# EAGLE design max636 (EAGLE 7.1.0)
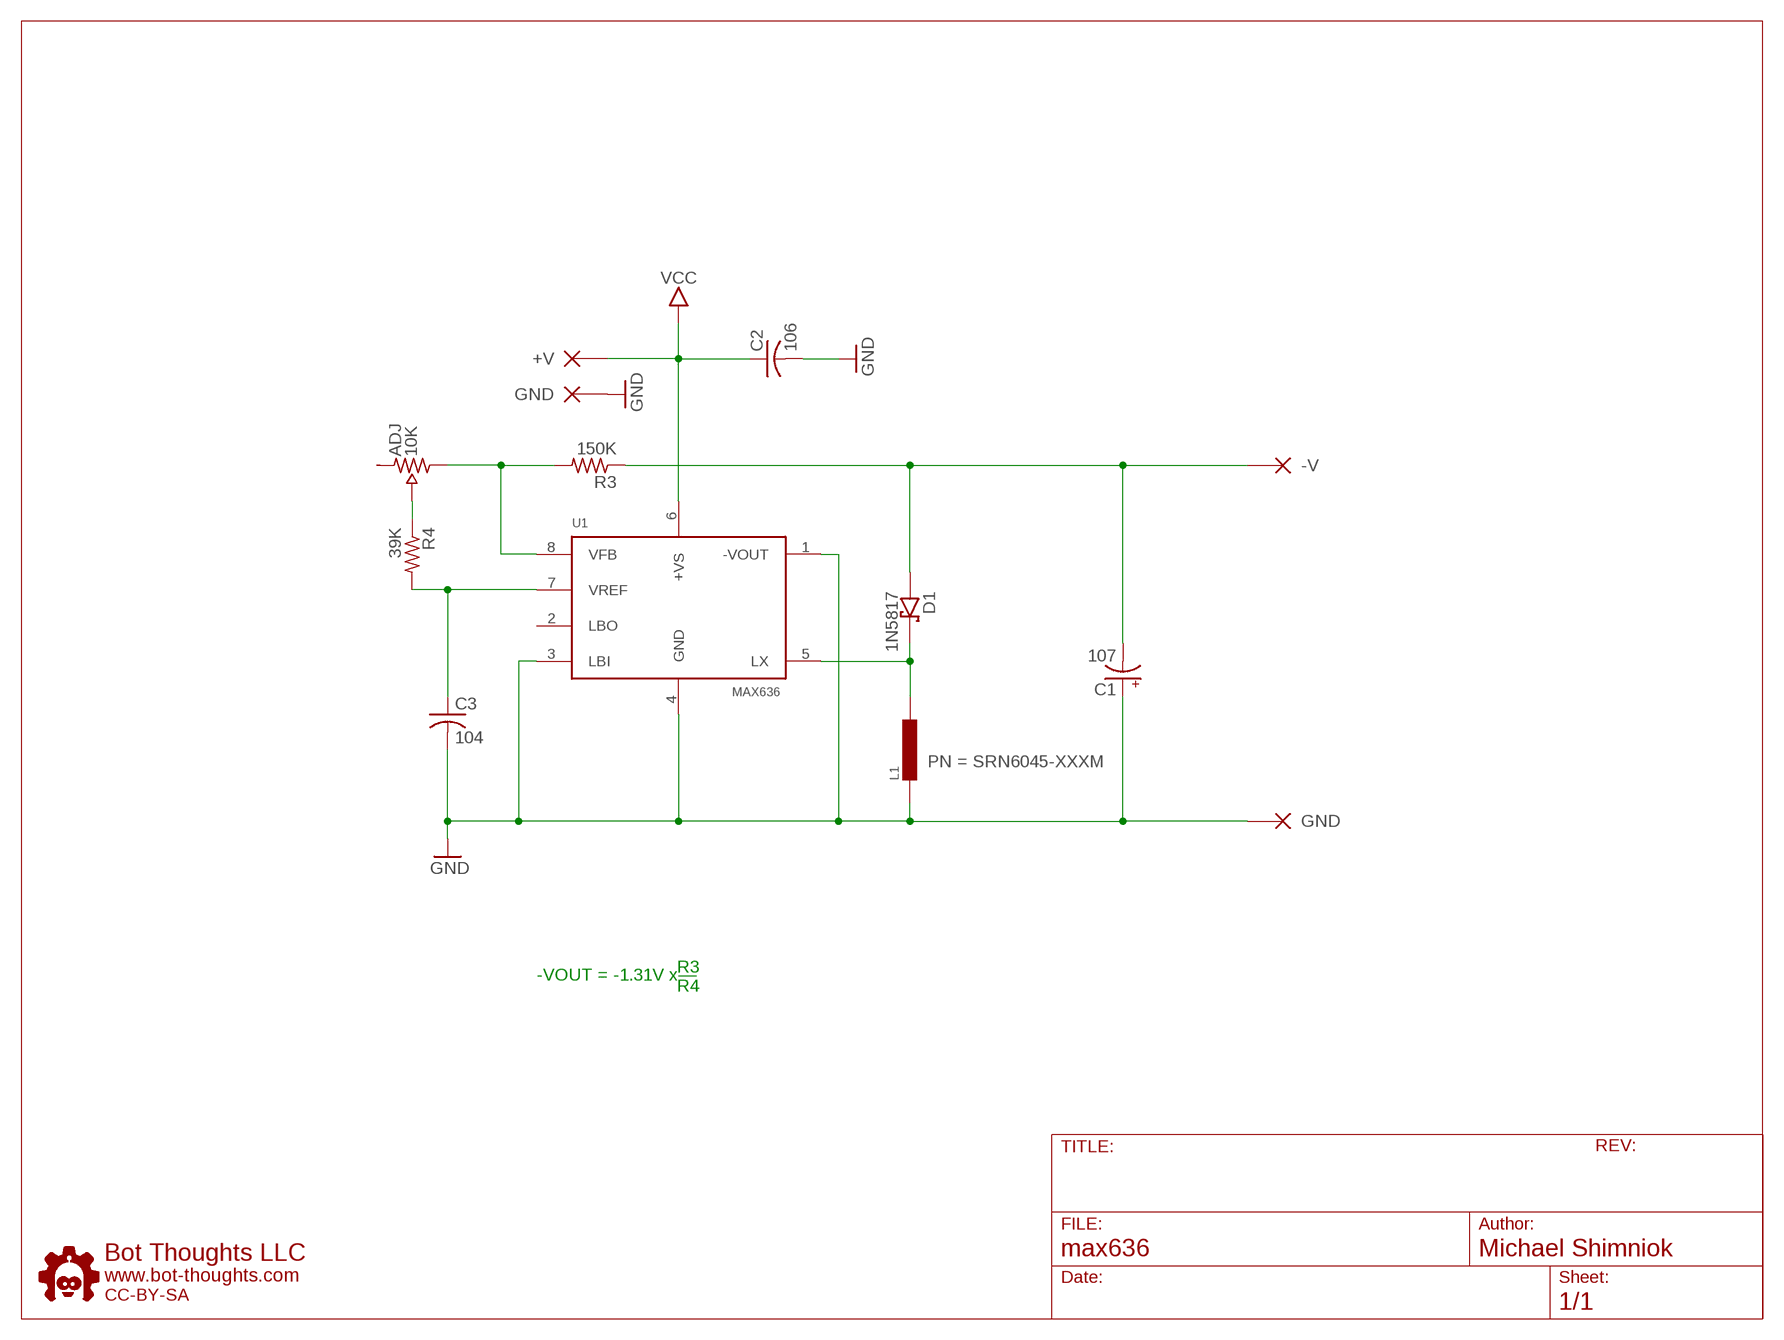
[diagram p0: schematic, sheet 1]

## Parts
ADJ  10K  TRIM-35WR  [35WR]
C1  107  CPOL_SMC_B  [SMC_B]
C2  106  C-0603  [0603]
C3  104  C-0603  [0603]
D1  1N5817  SCHOTTKY-DIODE-B5817WS-TP  [SOD-323]
J1  +V  PINHEAD-1  [1X01-S]
J2  -V  PINHEAD-1  [1X01-S]
J3  GND  PINHEAD-1  [1X01-S]
J4  GND  PINHEAD-1  [1X01-S]
L1  INDUCTOR-VLS6045EX  [VLS6045EX]
R3  150K  R0603  [0603]
R4  39K  R0603  [0603]
U1  MAX636  MAX636SO8  [SO08]
U$1  BTLOGO-LOGO-SM  [BTLOGOS]

## Nets
GND: C1.+ C2.2(-) C3.2(-) J3.1(P) J4.1(P) L1.1 U1.1(-VOUT) U1.3(LBI) U1.4(GND)
N$1: D1.C L1.2 U1.5(LX)
N$2: ADJ.1(A) R3.2 U1.8(VFB)
N$3: C1.- D1.A J2.1(P) R3.1
N$5: ADJ.2(WIPER) R4.1
N$6: C3.1(+) R4.2 U1.7(VREF)
VCC: C2.1(+) J1.1(P) U1.6(+VS)
Unconnected: ADJ.3(B) U1.2(LBO)

## Notes on the sheet
- -VOUT = -1.31V x
- R3
  R4

## Library data of the parts
ADJ = bt_electromech:TRIM-: POTENTIOMETER (TRIM, TRIMPOT, POT) 3-pin trim potentiometer in various packages
C1 = bt_rcl:CPOL: Capacitor, Polarized, American symbol
C2 C3 = bt_rcl:C: Capacitor, non-polarized, American symbol
D1 = bt_diode:SCHOTTKY-DIODE: Schottky Diode
J1-J4 = bt_electromech:PINHEAD-1: PIN HEADER 1x1, Small Symbol 1x1 pin header with small symbol makes it easier to build breakout boards
L1 = bt_inductor:INDUCTOR: Generic Inductor; PN: SRN6045-XXXM
R3 R4 = bt_rcl:R: Resistor, American symbol
U1 = bt_regulator:MAX636: MAX635, MAX636, MAX637 Inverting Switching Regulator The MAX635/MAX636/MAX637 inverting switching regulators are designed for minimum component DC-DC conversion in the 5mw to 500mW range. datasheet.pdf <https://www.analog.com/media/en/technical-documentation/data-sheets/max635-max637.pdf>
U$1 = bt:BTLOGO: Bot Thoughts Logo

## Board
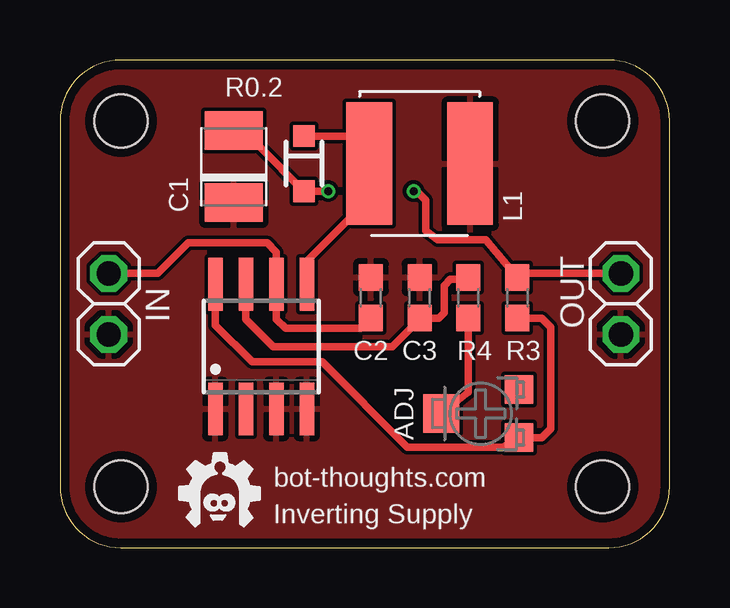
[diagram p1: board, top side]
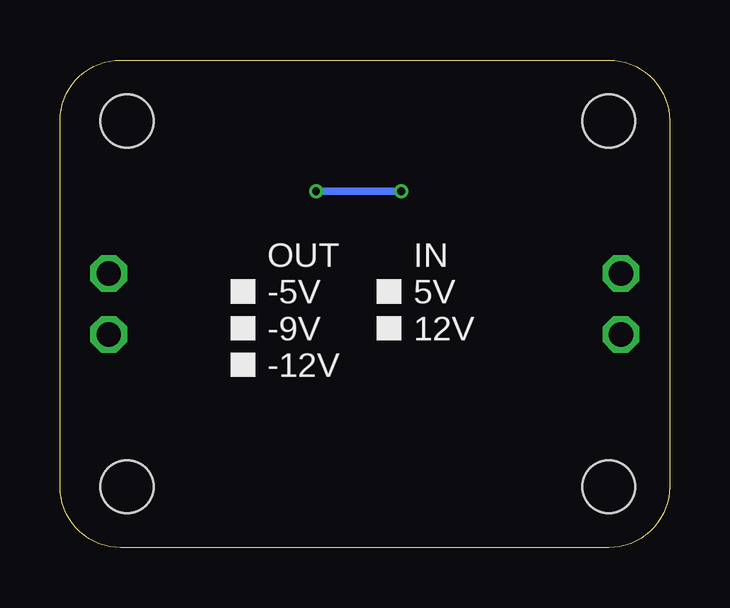
[diagram p2: board, bottom side, seen from below]

Size 25.4 x 20.32 mm. Coordinates in mm from the lower left corner, seen from the top.
Outline: 0,17.78 0,2.54 arc90 2.54,0 22.86,0 arc90 25.4,2.54 25.4,17.78 arc90 22.86,20.32 2.54,20.32 arc90 0,17.78
Copper layers (1*16): Top 0.035559375mm / dielectric 1.6mm / Bottom 0.035559375mm
Design rules "oshpark-2layer": minimum track width 6mil, minimum drill 10mil, track to track 6mil, track to pad 6mil, pad to pad 6mil, via to via 6mil, smd to smd 0mil, copper to edge 15mil, drill to drill 6mil, minimum pad ring 5mil, minimum via ring 5mil, stop-mask expansion 2.5mil, vias tented up to drill 13mil, thermal gap 10mil
Holes 2.2 mm at 2.54,2.54 2.54,17.78 22.61,17.78 22.61,2.54

### Footprints (pad centres in the part's own frame; a part is rotated, then mirrored left to right if it is on the bottom)
35WR = smd 1.2 x 1.2: 1 -1,-1.6; 3 1,-1.6 | smd 1.6 x 1.5: 2 0,1.65
SMC_B = smd 1.6 x 2.4: + -1.5,0; - 1.5,0
0603 = smd 1.1 x 1: 1 -0.85,0; 2 0.85,0
SOD-323 = smd 0.9 x 0.9: A 1.15,0; C -1.15,0
1X01-S = drill 1.016 octagon: 1 0,0
VLS6045EX = smd 1.9 x 5.1: 1 -2.1,0; 2 2.1,0
SO08 = smd 0.6 x 2.2: 1 -1.905,-2.6; 2 -0.635,-2.6; 3 0.635,-2.6; 4 1.905,-2.6; 5 1.905,2.6; 6 0.635,2.6; 7 -0.635,2.6; 8 -1.905,2.6

### Placement (x,y rotation side)
ADJ  17.53,5.59 90 top
C1  7.24,15.88 90 top
C2  12.95,10.41 90 top
C3  14.99,10.41 90 top
D1  10.16,16 270 top
J1  2.03,11.43 90 top
J2  23.37,11.43 90 top
J3  23.37,8.89 270 top
J4  2.03,8.89 270 top
L1  14.99,16 180 top
R3  19.05,10.41 270 top
R4  17.02,10.41 90 top
U1  8.38,8.38 0 top
U$1  6.6,0.76 0 top

### Tracks (layer width: path | path; a pad name or v marks a point on that pad's centre or on a via)
GND
  pour Top: 22.86,0 2.54,0 arc-90 0,2.54 0,17.78 arc-90 2.54,20.32 22.86,20.32 arc-90 25.4,17.78 25.4,2.54 arc-90
N$1
  Top 0.305: D1.C 12.5,17.15 L1.2 12.7,15.82 12.7,14.35 10.29,11.94 U1.5
N$2
  Top 0.305: U1.8 6.48,9.27 8,7.75 10.92,7.75 14.48,4.19 18.48,4.19 ADJ.1 20.08,4.59 20.45,4.95 20.45,9.2 20.08,9.56 R3.2
N$3  (via drill 0.33)
  Top 0.305: C1.- 8.27,16.74 D1.A 10.92,14.86 v11.18,14.86 | J2.1 19.14,11.43 R3.1 17.74,12.83 15.75,12.83 15.24,13.21 15.24,14.48 14.86,14.86 v14.73,14.86
  Bottom 0.305: v11.18,14.86 v14.73,14.86
N$5
  Top 0.305: R4.1 17.02,6.48 ADJ.2
N$6
  Top 0.305: U1.7 7.75,9.53 8.89,8.38 13.84,8.38 14.73,9.27 C3.1 15.79,9.56 16,9.78 16,10.92 16.26,11.18 16.93,11.18 R4.2
VCC
  Top 0.305: J1.1 4.06,11.43 5.33,12.7 8.64,12.7 9.02,12.32 U1.6 9.02,9.53 9.4,9.14 12.53,9.14 C2.1

### Text on the board
tNames: R0.2 | IN | OUT | bot-thoughts.com | Inverting Supply
bNames: IN / 5V / 12V | OUT / -5V / -9V / -12V